# EasyEDA schematic SCH_EspNowHub_2023-01-29.json

## Sheets
1 CPU: TITLE: Sheet_1; REV: 1.0; Date: 2022-03-05; Sheet: 1/1; Drawn By: Tom Freier; Company: Your Company
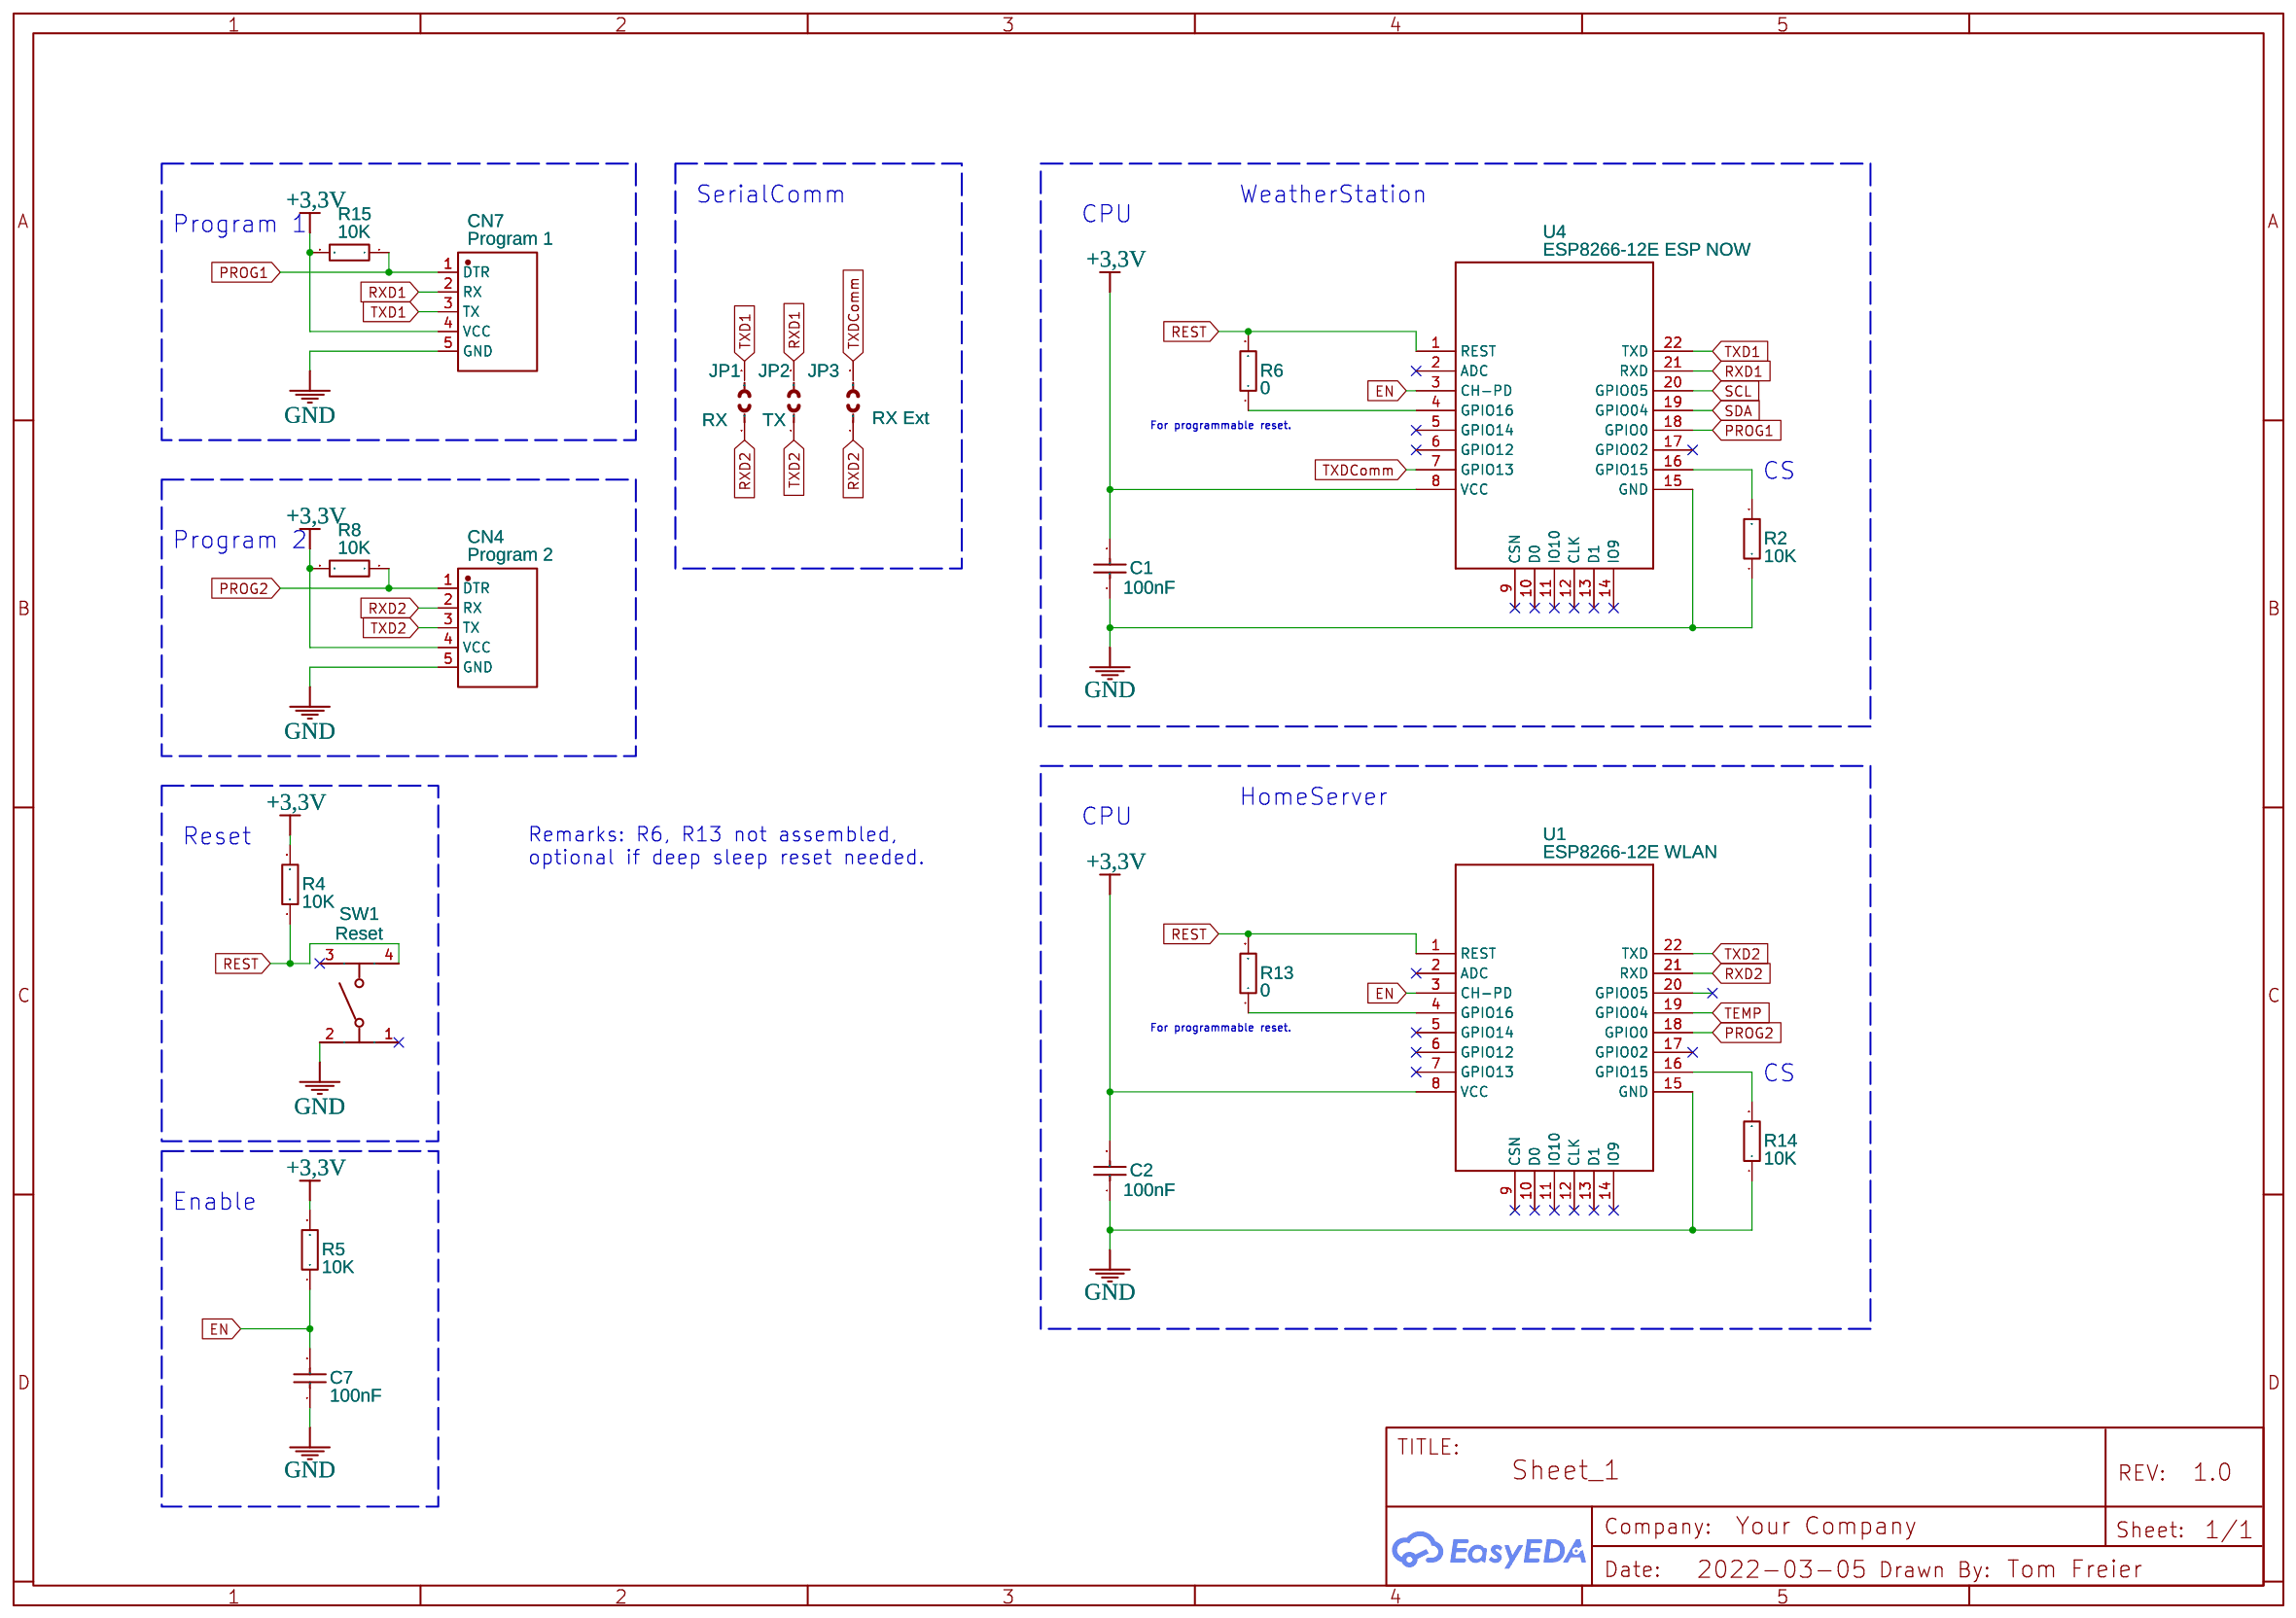
[diagram p0: CPU]
2 Power Supply Sensor: Date: 2020-05-02; Drawn By: Thomas_2213
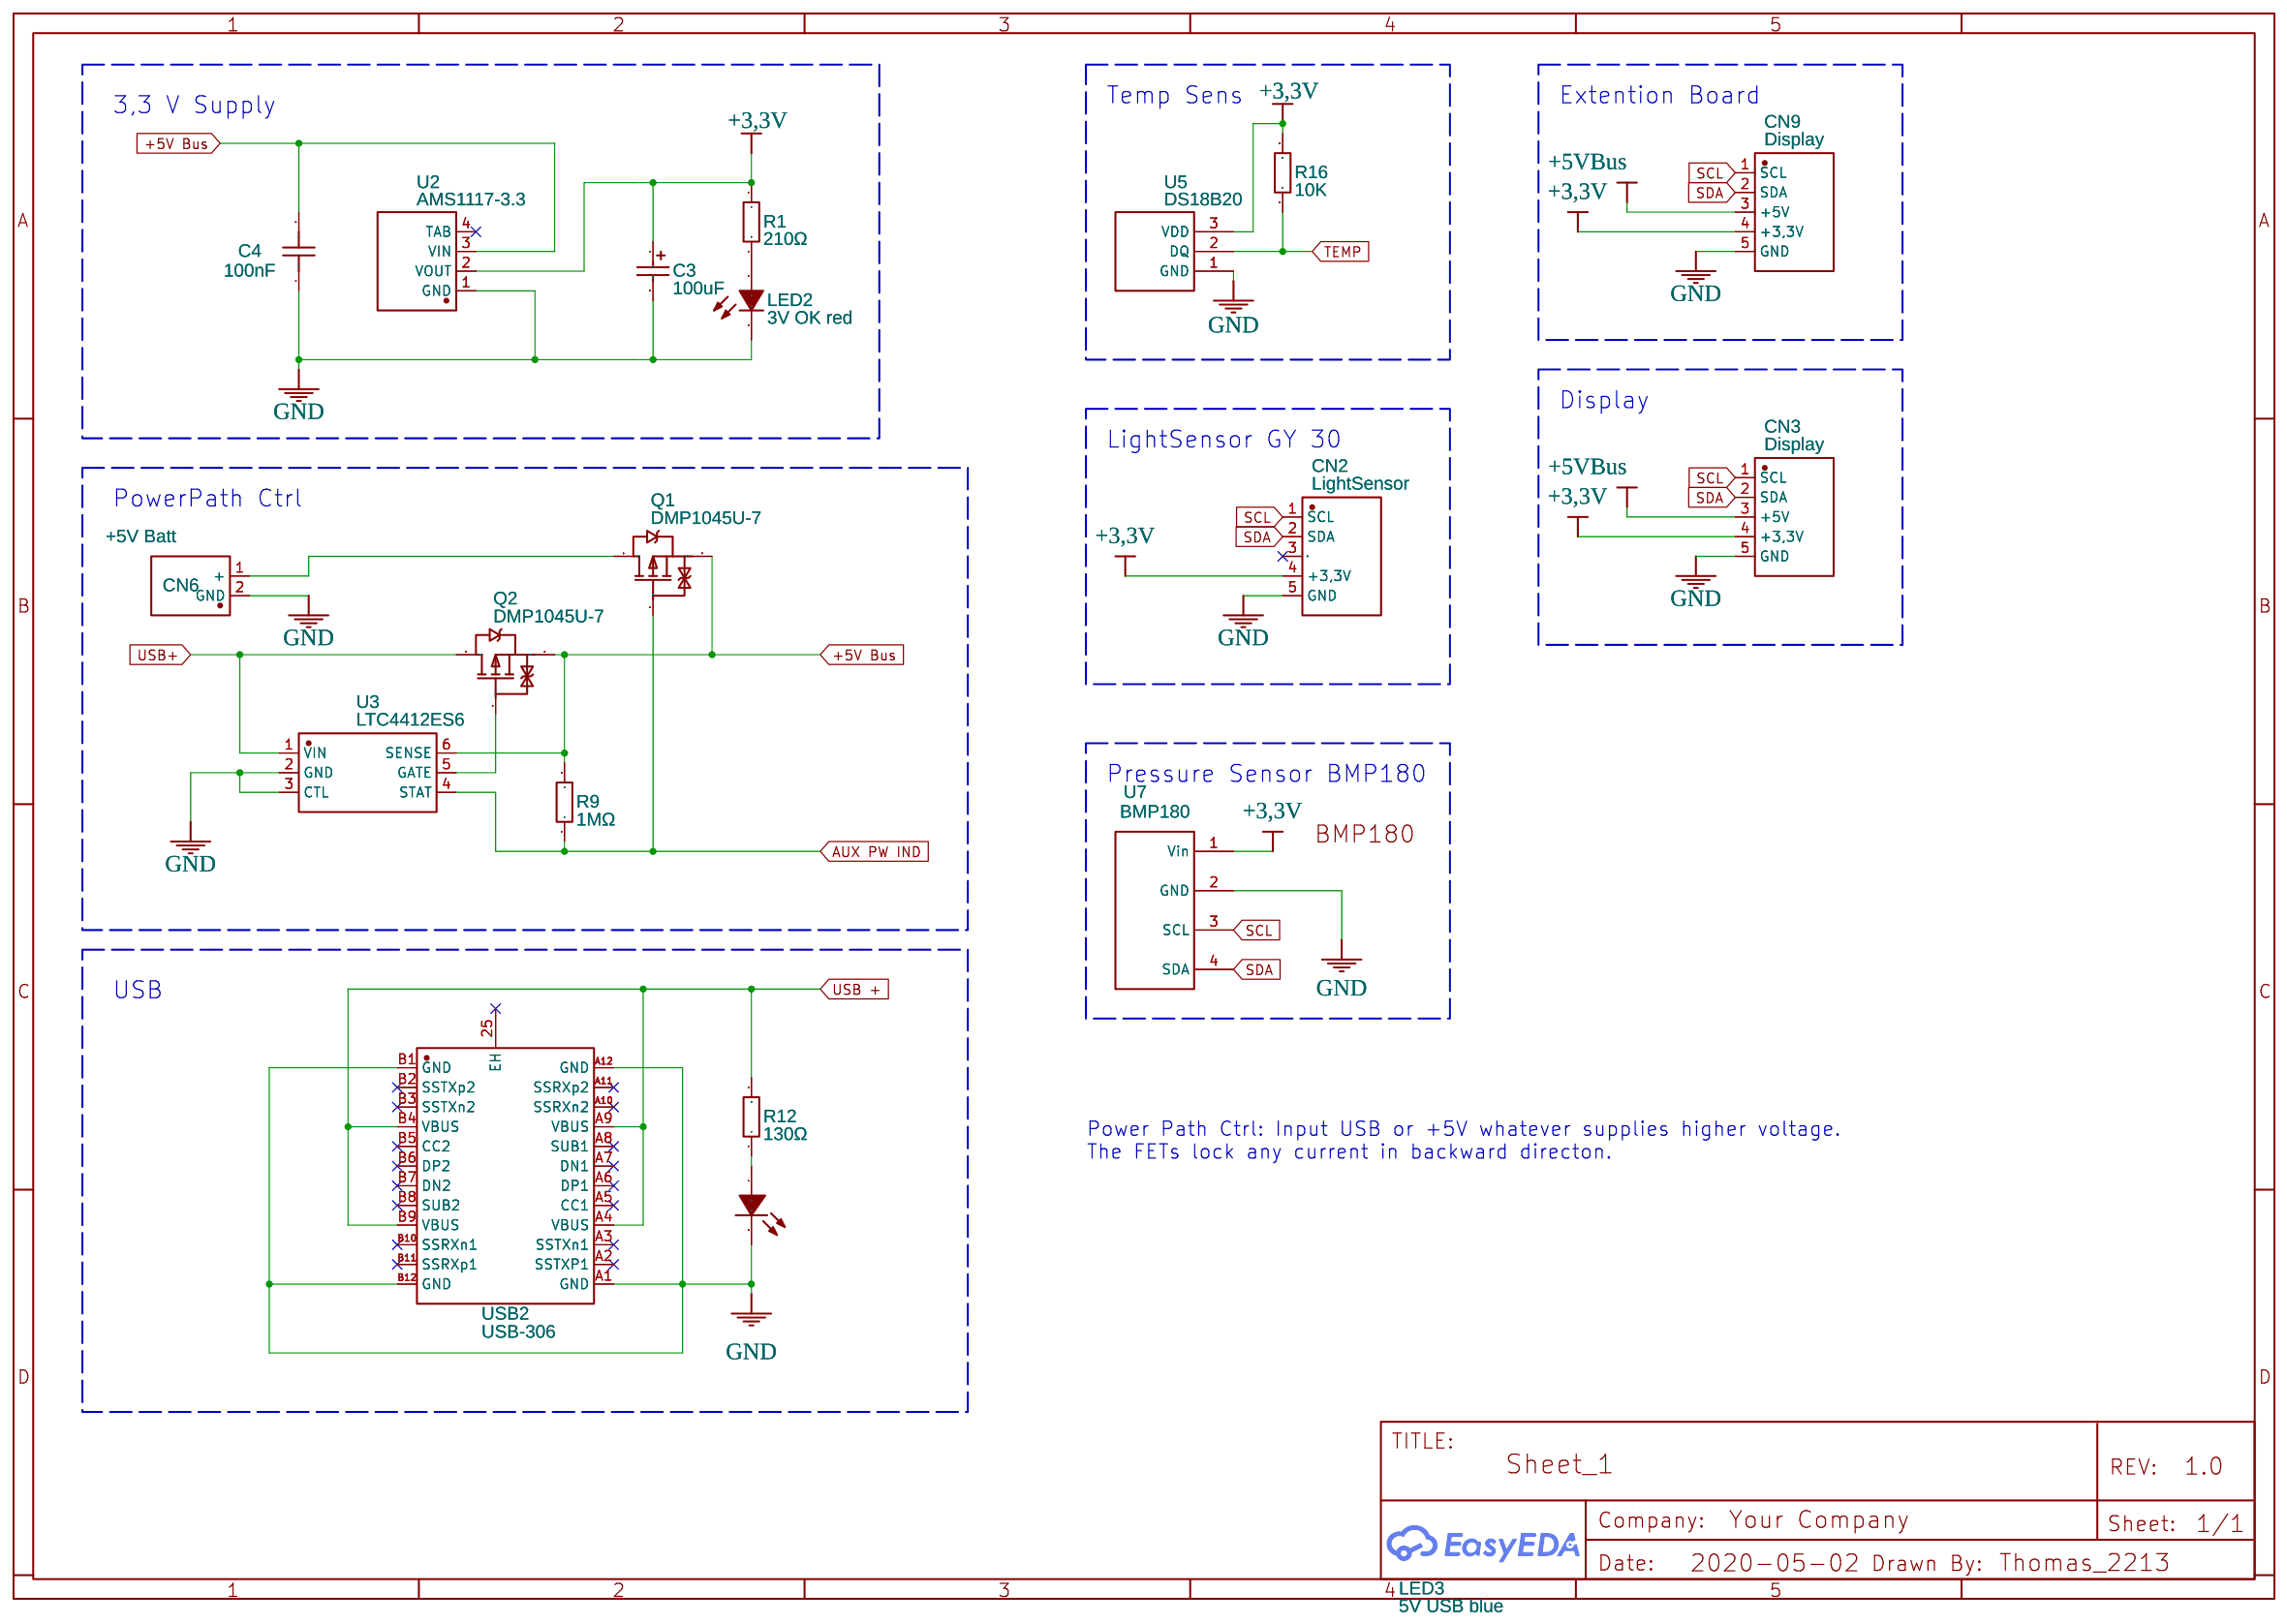
[diagram p1: Power Supply Sensor]

## Parts
sheet CPU
C1  100nF  [0603]
C2  100nF  [0603]
C7  100nF  [0603]
CN4  Program 2  [CONN-TH_B5B-XH-AM (LF)(SN)]
CN7  Program 1  [CONN-TH_B5B-XH-AM (LF)(SN)]
JP1  RX  [SPARKFUN-JUMPERS_SMT-JUMPER_2_NC_PASTE_NO-SILK]
JP2  TX  [SPARKFUN-JUMPERS_SMT-JUMPER_2_NC_PASTE_NO-SILK]
JP3  RX Ext  [SPARKFUN-JUMPERS_SMT-JUMPER_2_NC_PASTE_NO-SILK]
R2  10K  [0603]
R4  10K  [0603]
R5  10K  [0603]
R6  0  [R0603]
R8  10K  [0603]
R13  0  [R0603]
R14  10K  [0603]
R15  10K  [0603]
SW1  Reset  [KEY-SMD_4P-L6.0-W6.0-P4.50-LS10.0]
U1  ESP8266-12E WLAN  [LGA22-2.0-24X16MM]
U4  ESP8266-12E ESP NOW  [LGA22-2.0-24X16MM]
sheet Power Supply Sensor
C3  100uF  [CAP-SMD_L7.3-W4.3-R-RD]
C4  100nF  [C0603]
CN2  LightSensor  [CONN-TH_B5B-XH-AM (LF)(SN)]
CN3  Display  [CONN-TH_B5B-XH-AM (LF)(SN)]
CN6  +5V Batt  [CONN-TH_B2B-XH-AM-LF-SN]
CN9  Display  [CONN-TH_B5B-XH-AM (LF)(SN)]
LED2  3V OK red  [LED0805-R-RD]
LED3  5V USB blue  [LED0805-R-RD]
Q1  DMP1045U-7  [SOT-23-3_L2.9-W1.3-P1.90-LS2.4-BR]
Q2  DMP1045U-7  [SOT-23-3_L2.9-W1.3-P1.90-LS2.4-BR]
R1  210Ω  [R0603]
R9  1MΩ  [R0603]
R12  130Ω  [R0603]
R16  10K  [0603]
U2  AMS1117-3.3  [PG-SOT223-4_L6.5-W3.5-P2.30-LS7.0-BR]
U3  LTC4412ES6  [TSOT-23-6_L2.9-W1.6-P0.95-LS2.8-BR]
U5  DS18B20  [TO-92(TO-92-3)]
U7  BMP180  [BMP180]
USB2  USB-306  [USB-TYPE-C-TH_USB-306.]

## Library data of the parts
C1 C2 = CL10B104JB8NNNC: Supplier: LCSC; Manufacturer Part: CL10B104KC8NNNC; Manufacturer: SAMSUNG; Supplier Part: C1688; LCSC Assembly: Yes; SMT Type: Extend
C7 = CL10B104JB8NNNC: Supplier: LCSC; Manufacturer: SAMSUNG; Supplier Part: C1688; LCSC Assembly: Yes; SMT Type: Extend
CN2-CN4 CN7 CN9 = B5B-XH-AM (LF)(SN): Supplier: LCSC; Supplier Part: C161872; Manufacturer: JST Sales America; Contributor: LCSC
JP1 = JumperOpenNoPaste: Contributor: Tom Freier; Package Display: No
JP2 JP3 = JumperOpenNoPaste: Contributor: Tom Freier
R2 R14 R16 = TC0310B1002T5E: Supplier: LCSC; Supplier Part: C39050; Manufacturer: UniOhm; Manufacturer Part: TC0325B1002T5E; Contributor: LCSC; LCSC Assembly: Yes; SMT Type: Extend
R4 R5 R8 R15 = TC0310B1002T5E: Supplier: LCSC; Supplier Part: C190321; Manufacturer: Uniroyal Elec; Contributor: LCSC; LCSC Assembly: Yes; SMT Type: Extend
R6 R13 = 0603WAJ0000T5E: Supplier: LCSC; Manufacturer: UniOhm; Supplier Part: C15402
SW1 = TL3301TF160QG/D310794: Supplier: LCSC; Supplier Part: C273532; Manufacturer: E-Switch; Contributor: LCSC
U1 U4 = -: SMD ESP8266 based WiFi module FCC/CE; Supplier Part: 317060015; Supplier: SeeedStudio; Manufacturer Part: ESP8266-12E/ESP-12E; sourceId: x7jTsOM8S
C3 = CA45-D-16V-100UF-K: Supplier: LCSC; Manufacturer: CEC; Supplier Part: C129274; JLCPCB Part Class: Extended Part
C4 = CL10B104KC8NNNC: Supplier: LCSC; Manufacturer: SAMSUNG; Supplier Part: C1688; LCSC Assembly: Yes; SMT Type: Extend
CN6 = B2B-XH-AM (LF)(SN): Supplier: LCSC; Supplier Part: C161869; Manufacturer: JST Sales America; Contributor: LCSC; JLCPCB Part Class: Extended Part; Package Display: No
LED2 = 17-21SURC/S530-A3/TR8: Supplier: LCSC; Manufacturer: EVERLIGHT; Supplier Part: C72037; JLCPCB Part Class: Extended Part
LED3 = FC-2012UGK-520D5: Supplier: LCSC; Manufacturer: NATIONSTAR; Supplier Part: C84260; JLCPCB Part Class: Extended Part
Q1 Q2 = DMP1045U-7: Supplier: LCSC; Supplier Part: C177033; Manufacturer: Diodes Incorporated; Contributor: LCSC; JLCPCB Part Class: Extended Part
R1 = 0603WAF2100T5E: Supplier: LCSC; Manufacturer: UniOhm; Supplier Part: C22953; Resistance (Ohms): 210; JLCPCB Part Class: Extended Part
R9 = 0603WAF1004T5E: Supplier: LCSC; Manufacturer: UniOhm; Supplier Part: C22935; Resistance (Ohms): 1M; JLCPCB Part Class: Basic Part
R12 = 0603WAF1300T5E: Supplier: LCSC; Manufacturer: UniOhm; Supplier Part: C22796; Resistance (Ohms): 130; JLCPCB Part Class: Extended Part
U2 = AMS1117-3.3_C498117: Supplier: LCSC; Supplier Part: C498117; Manufacturer: HGC(Huaguan Semicon); Contributor: LCSC; JLCPCB Part Class: Extended Part
U3 = LTC4412ES6#TRPBF: Supplier: LCSC; Supplier Part: C514442; Manufacturer: Analog Devices; Contributor: LCSC; JLCPCB Part Class: Extended Part
U5 = -: Supplier Part: C9753; Supplier: LCSC; Manufacturer: MAXIM; Manufacturer Part: DS18B20+; image: //image.lceda.cn/szlcsc/C9753.jpg
U7 = BMP180: Manufacturer Part: PROJ_LIC Lib; Contributor: vlad.mocan
USB2 = USB-306: Supplier: LCSC; Supplier Part: C309338; Manufacturer: HOOYA; Contributor: LCSC; Package Display: No

## Nets
+5V Bus: C4.2 Q1.2(S) Q2.2(S) R9.2 U2.3(VIN) U3.6(SENSE)
+5VBus: CN3.3(+5V) CN9.3(+5V)
GND: C1.1 C2.1 C3.2 C4.1 C7.1 CN2.5(GND) CN3.5(GND) CN4.5(GND) CN6.2(GND) CN7.5(GND) CN9.5(GND) LED2.2(C) LED3.2(K) R2.1 R14.1 SW1.2 U1.15(GND) U2.1(GND) U3.2(GND) U3.3(CTL) U4.15(GND) U5.1(GND) U7.2(GND) USB2.A1(GND) USB2.A12(GND) USB2.B1(GND) USB2.B12(GND)
+3,3V: C1.2 C2.2 C3.1 CN2.4(+3,3V) CN3.4(+3,3V) CN4.4(VCC) CN7.4(VCC) CN9.4(+3,3V) R1.1 R4.2 R5.2 R8.2 R15.2 R16.2 U1.8(VCC) U2.2(VOUT) U4.8(VCC) U5.3(VDD) U7.1(Vin)
AUX PW IND: Q1.1(G) R9.1 U3.4(STAT)
EN: C7.2 R5.1 U1.3(CH-PD) U4.3(CH-PD)
PROG1: CN7.1(DTR) R15.1 U4.18(GPIO0)
PROG2: CN4.1(DTR) R8.1 U1.18(GPIO0)
REST: R4.1 R6.2 R13.2 SW1.4 U1.1(REST) U4.1(REST)
RXD1: CN7.2(RX) JP2.2 U4.21(RXD)
RXD2: CN4.2(RX) JP1.1 JP3.1 U1.21(RXD)
SCL: CN2.1(SCL) CN3.1(SCL) CN9.1(SCL) U4.20(GPIO05) U7.3(SCL)
SDA: CN2.2(SDA) CN3.2(SDA) CN9.2(SDA) U4.19(GPIO04) U7.4(SDA)
TEMP: R16.1 U1.19(GPIO04) U5.2(DQ)
TXD1: CN7.3(TX) JP1.2 U4.22(TXD)
TXD2: CN4.3(TX) JP2.1 U1.22(TXD)
TXDComm: JP3.2 U4.7(GPIO13)
USB +: R12.2 USB2.A4(VBUS) USB2.A9(VBUS) USB2.B4(VBUS) USB2.B9(VBUS)
USB+: Q2.3(D) U3.1(VIN)
Net-(CN6-1): CN6.1(+) Q1.3(D)
Net-(LED2-1): LED2.1(A) R1.2
Net-(LED3-1): LED3.1(A) R12.1
Net-(Q2-1): Q2.1(G) U3.5(GATE)
Net-(R2-2): R2.2 U4.16(GPIO15)
Net-(R6-1): R6.1 U4.4(GPIO16)
Net-(R13-1): R13.1 U1.4(GPIO16)
Net-(R14-2): R14.2 U1.16(GPIO15)

Not connected (* = marked no-connect by the designer): CN2 3(+5V)*; SW1 1* 3*; U1 2(ADC)* 5(GPIO14)* 6(GPIO12)* 7(GPIO13)* 9(CSN)* 10(D0)* 11(IO10)* 12(CLK)* 13(D1)* 14(IO9)* 17(GPIO02)* 20(GPIO05); U2 4(TAB)*; U4 2(ADC)* 5(GPIO14)* 6(GPIO12)* 9(CSN)* 10(D0)* 11(IO10)* 12(CLK)* 13(D1)* 14(IO9)* 17(GPIO02)*; USB2 25(EH)* A2(SSTXP1)* A3(SSTXn1)* A5(CC1)* A6(DP1)* A7(DN1)* A8(SUB1)* A10(SSRXn2)* A11(SSRXp2)* B2(SSTXp2)* B3(SSTXn2)* B5(CC2)* B6(DP2)* B7(DN2)* B8(SUB2)* B10(SSRXn1)* B11(SSRXp1)*

## Notes on the sheets
sheet 1
- SerialComm
- WeatherStation
- CPU
- Program 1
- For programmable reset.
- CS
- Program 2
- HomeServer
- CPU
- Reset
- Remarks: R6, R13 not assembled,
  optional if deep sleep reset needed.
- For programmable reset.
- CS
- Enable
sheet 2
- Temp Sens
- Extention Board
- 3,3 V Supply
- Display
- LightSensor GY 30
- PowerPath Ctrl
- Pressure Sensor BMP180
- USB
- Power Path Ctrl: Input USB or +5V whatever supplies higher voltage.
  The FETs lock any current in backward directon.
